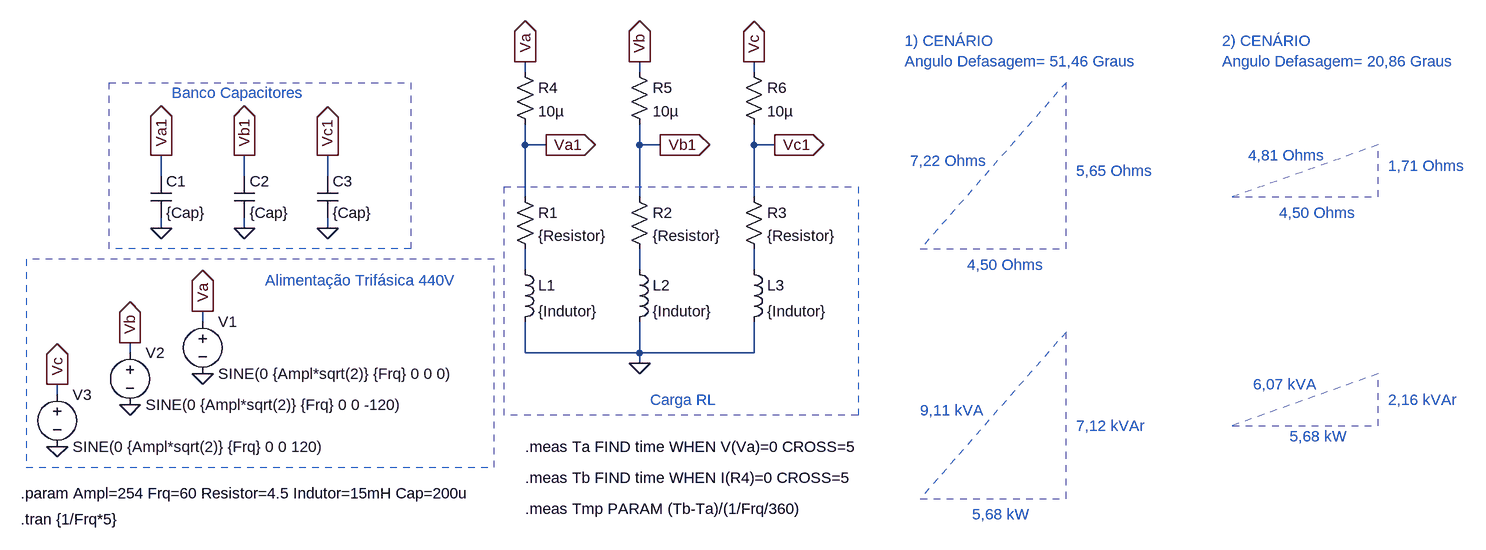
[diagram p0: schematic FatorPotenciaFundamento.asc]
FatorPotenciaFundamento.asc, the LTspice schematic file:
Version 4
SHEET 1 2160 680
WIRE 704 -112 704 -128
WIRE 880 -112 880 -128
WIRE 1056 -112 1056 -128
WIRE 704 0 704 -32
WIRE 736 0 704 0
WIRE 880 0 880 -32
WIRE 912 0 880 0
WIRE 1056 0 1056 -32
WIRE 1088 0 1056 0
WIRE 144 48 144 16
WIRE 272 48 272 16
WIRE 400 48 400 16
WIRE 704 80 704 0
WIRE 880 80 880 0
WIRE 1056 80 1056 0
WIRE 144 128 144 112
WIRE 272 128 272 112
WIRE 400 128 400 112
WIRE 704 192 704 160
WIRE 880 192 880 160
WIRE 1056 192 1056 160
WIRE 208 272 208 256
WIRE 96 320 96 304
WIRE 704 320 704 272
WIRE 880 320 880 272
WIRE 880 320 704 320
WIRE 1056 320 1056 272
WIRE 1056 320 880 320
WIRE 880 336 880 320
WIRE -16 384 -16 368
FLAG 208 352 0
FLAG 208 256 Va
IOPIN 208 256 Out
FLAG 96 400 0
FLAG 96 304 Vb
IOPIN 96 304 Out
FLAG -16 464 0
FLAG -16 368 Vc
IOPIN -16 368 Out
FLAG 880 336 0
FLAG 704 -128 Va
IOPIN 704 -128 Out
FLAG 880 -128 Vb
IOPIN 880 -128 Out
FLAG 1056 -128 Vc
IOPIN 1056 -128 Out
FLAG 144 128 0
FLAG 272 128 0
FLAG 400 128 0
FLAG 144 16 Va1
IOPIN 144 16 Out
FLAG 272 16 Vb1
IOPIN 272 16 Out
FLAG 400 16 Vc1
IOPIN 400 16 Out
FLAG 736 0 Va1
IOPIN 736 0 Out
FLAG 912 0 Vb1
IOPIN 912 0 Out
FLAG 1088 0 Vc1
IOPIN 1088 0 Out
SYMBOL voltage 208 256 R0
WINDOW 123 0 0 Left 0
WINDOW 39 0 0 Left 0
SYMATTR InstName V1
SYMATTR Value SINE(0 {Ampl*sqrt(2)} {Frq} 0 0 0)
SYMBOL voltage 96 304 R0
WINDOW 123 0 0 Left 0
WINDOW 39 0 0 Left 0
SYMATTR InstName V2
SYMATTR Value SINE(0 {Ampl*sqrt(2)} {Frq} 0 0 -120)
SYMBOL voltage -16 368 R0
WINDOW 123 0 0 Left 0
WINDOW 39 0 0 Left 0
SYMATTR InstName V3
SYMATTR Value SINE(0 {Ampl*sqrt(2)} {Frq} 0 0 120)
SYMBOL ind 688 176 R0
SYMATTR InstName L1
SYMATTR Value {Indutor}
SYMBOL ind 864 176 R0
SYMATTR InstName L2
SYMATTR Value {Indutor}
SYMBOL ind 1040 176 R0
SYMATTR InstName L3
SYMATTR Value {Indutor}
SYMBOL res 688 64 R0
SYMATTR InstName R1
SYMATTR Value {Resistor}
SYMBOL res 864 64 R0
SYMATTR InstName R2
SYMATTR Value {Resistor}
SYMBOL res 1040 64 R0
SYMATTR InstName R3
SYMATTR Value {Resistor}
SYMBOL cap 128 48 R0
SYMATTR InstName C1
SYMATTR Value {Cap}
SYMBOL cap 256 48 R0
SYMATTR InstName C2
SYMATTR Value {Cap}
SYMBOL cap 384 48 R0
SYMATTR InstName C3
SYMATTR Value {Cap}
SYMBOL res 688 -128 R0
SYMATTR InstName R4
SYMATTR Value 10µ
SYMBOL res 864 -128 R0
SYMATTR InstName R5
SYMATTR Value 10µ
SYMBOL res 1040 -128 R0
SYMATTR InstName R6
SYMATTR Value 10µ
TEXT -72 536 Left 2 !.param Ampl=254 Frq=60 Resistor=4.5 Indutor=15mH Cap=200u
TEXT -72 576 Left 2 !.tran {1/Frq*5}
TEXT 704 464 Left 2 !.meas Ta FIND time WHEN V(Va)=0 CROSS=5
TEXT 704 512 Left 2 !.meas Tb FIND time WHEN I(R4)=0 CROSS=5
TEXT 704 560 Left 2 !.meas Tmp PARAM (Tb-Ta)/(1/Frq/360)
TEXT 160 -80 Left 2 ;Banco Capacitores
TEXT 896 392 Left 2 ;Carga RL
TEXT 304 208 Left 2 ;Alimentação Trifásica 440V
TEXT 1384 184 Left 2 ;4,50 Ohms
TEXT 1552 40 Left 2 ;5,65 Ohms
TEXT 1296 24 Left 2 ;7,22 Ohms
TEXT 1392 568 Left 2 ;5,68 kW
TEXT 1552 432 Left 2 ;7,12 kVAr
TEXT 1312 408 Left 2 ;9,11 kVA
TEXT 1288 -160 Left 2 ;1) CENÁRIO\nAngulo Defasagem= 51,46 Graus
TEXT 1864 104 Left 2 ;4,50 Ohms
TEXT 2032 32 Left 2 ;1,71 Ohms
TEXT 1816 16 Left 2 ;4,81 Ohms
TEXT 1880 448 Left 2 ;5,68 kW
TEXT 2032 392 Left 2 ;2,16 kVAr
TEXT 1824 368 Left 2 ;6,07 kVA
TEXT 1776 -160 Left 2 ;2) CENÁRIO\nAngulo Defasagem= 20,86 Graus
LINE Normal 1536 -96 1312 160 2
LINE Normal 1536 160 1536 -96 2
LINE Normal 1312 160 1536 160 2
LINE Normal 1536 288 1312 544 2
LINE Normal 1536 544 1536 288 2
LINE Normal 1312 544 1536 544 2
LINE Normal 1792 80 2016 80 2
LINE Normal 2016 0 1792 80 2
LINE Normal 2016 80 2016 0 2
LINE Normal 1792 432 2016 432 2
LINE Normal 2016 352 1792 432 2
LINE Normal 2016 432 2016 352 2
RECTANGLE Normal 528 160 64 -96 2
RECTANGLE Normal 656 176 -64 496 2
RECTANGLE Normal 1216 416 672 64 2

The netlist it stands for:
* FatorPotenciaFundamento.asc
V1 Va 0 SINE(0 {Ampl*sqrt(2)} {Frq} 0 0 0)
V2 Vb 0 SINE(0 {Ampl*sqrt(2)} {Frq} 0 0 -120)
V3 Vc 0 SINE(0 {Ampl*sqrt(2)} {Frq} 0 0 120)
L1 N001 0 {Indutor}
L2 N002 0 {Indutor}
L3 N003 0 {Indutor}
R1 Va1 N001 {Resistor}
R2 Vb1 N002 {Resistor}
R3 Vc1 N003 {Resistor}
C1 Va1 0 {Cap}
C2 Vb1 0 {Cap}
C3 Vc1 0 {Cap}
R4 Va Va1 10µ
R5 Vb Vb1 10µ
R6 Vc Vc1 10µ
.param Ampl=254 Frq=60 Resistor=4.5 Indutor=15mH Cap=200u
.tran {1/Frq*5}
.meas Ta FIND time WHEN V(Va)=0 CROSS=5
.meas Tb FIND time WHEN I(R4)=0 CROSS=5
.meas Tmp PARAM (Tb-Ta)/(1/Frq/360)
* Banco Capacitores
* Carga RL
* Alimentação Trifásica 440V
* 4,50 Ohms
* 5,65 Ohms
* 7,22 Ohms
* 5,68 kW
* 7,12 kVAr
* 9,11 kVA
* 1) CENÁRIO
* Angulo Defasagem= 51,46 Graus
* 4,50 Ohms
* 1,71 Ohms
* 4,81 Ohms
* 5,68 kW
* 2,16 kVAr
* 6,07 kVA
* 2) CENÁRIO
* Angulo Defasagem= 20,86 Graus
.backanno
.end